# Altium schematic sheet test.SchDoc
size A4
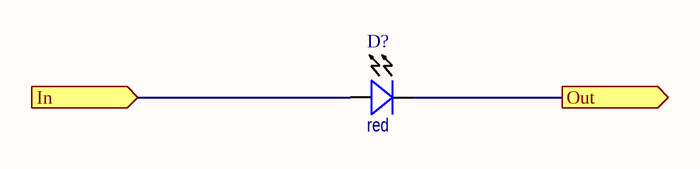
[diagram p0: test.SchDoc]

## Parts
D?  value red  [LED-0805]  (hidden comment: LED)

## Ports
In (in), Out (out)

## Nets
In: D?.1(A) ; port In
Out: D?.2(K) ; port Out

## Library data of the parts
D? = LED: Назначение: Светодиод; Наименование: SMD-LED; Потребление, Вт: 0,01